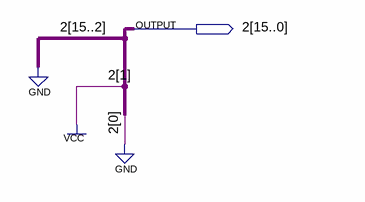
[diagram p0: schematic sheet]
// Quartus schematic 2.bdf as structural Verilog: 0 symbols, 1 pins
module \2  (
  output [15:0] \2 
);


  assign \2  = 16'b0000000000000010;
endmodule
